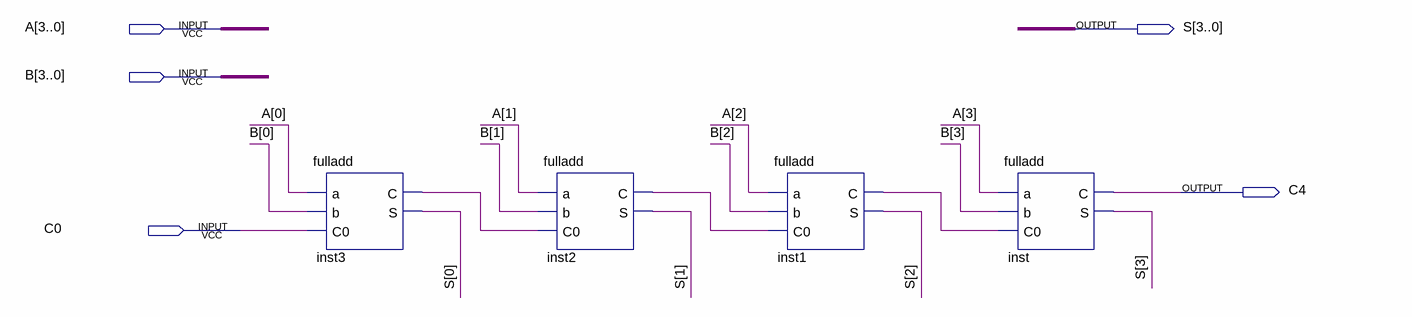
[diagram p0: schematic sheet]
// Quartus schematic ep3_1.bdf as structural Verilog: 4 symbols, 5 pins
module ep3_1 (
  input  [3:0] A,
  input  [3:0] B,
  input  C0,
  output [3:0] S,
  output C4
);

  wire inst1_c, inst2_c, inst3_c;

  fulladd inst3 (.a(A[0]), .b(B[0]), .C0(C0), .C(inst3_c), .S(S[0]));
  fulladd inst2 (.a(A[1]), .b(B[1]), .C0(inst3_c), .C(inst2_c), .S(S[1]));
  fulladd inst1 (.a(A[2]), .b(B[2]), .C0(inst2_c), .C(inst1_c), .S(S[2]));
  fulladd inst (.a(A[3]), .b(B[3]), .C0(inst1_c), .C(C4), .S(S[3]));
endmodule
